# EAGLE board ACB Jr. r.02 (EAGLE 8.6.3)
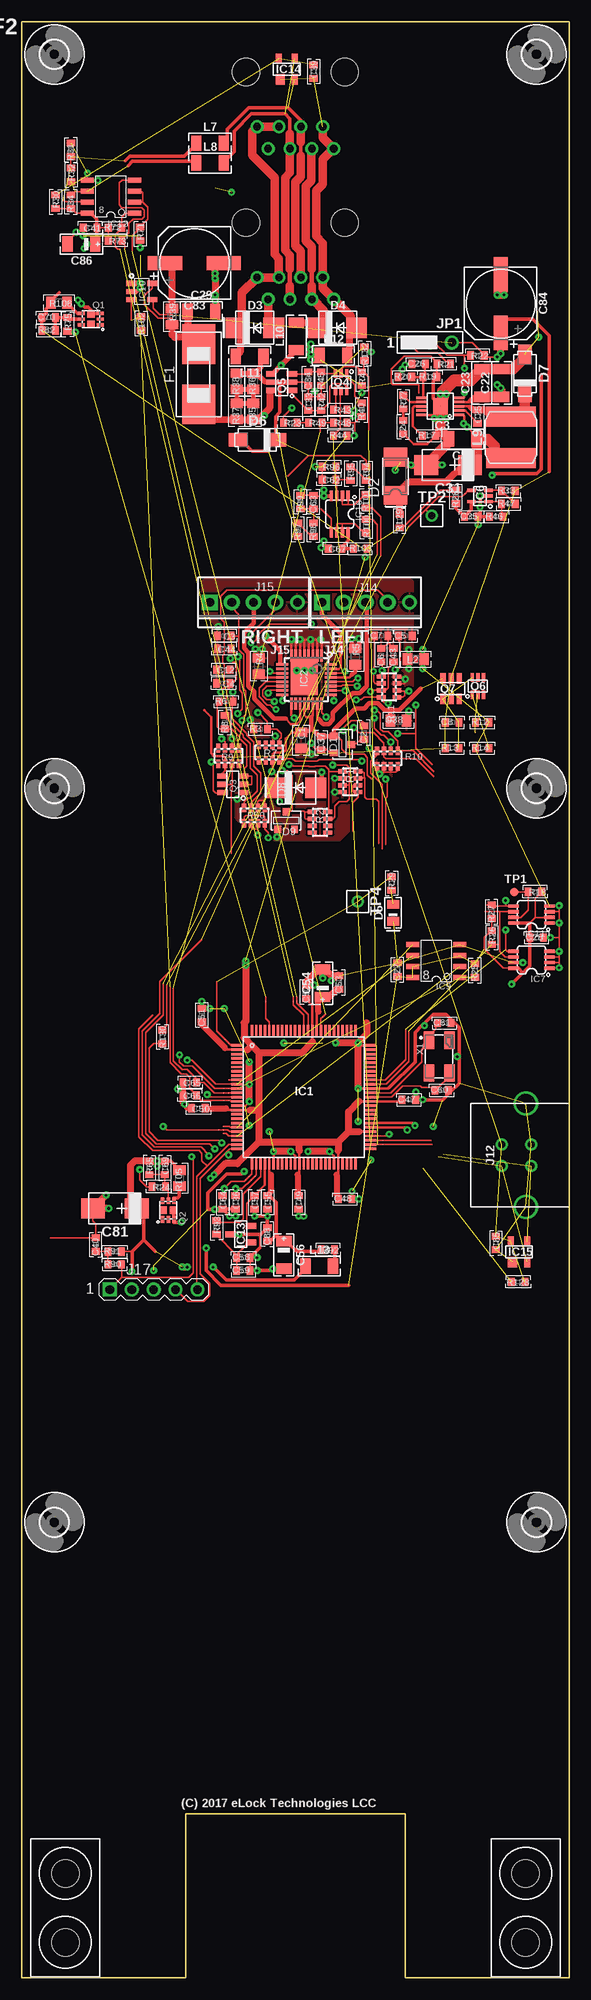
[diagram p6: board, top side]
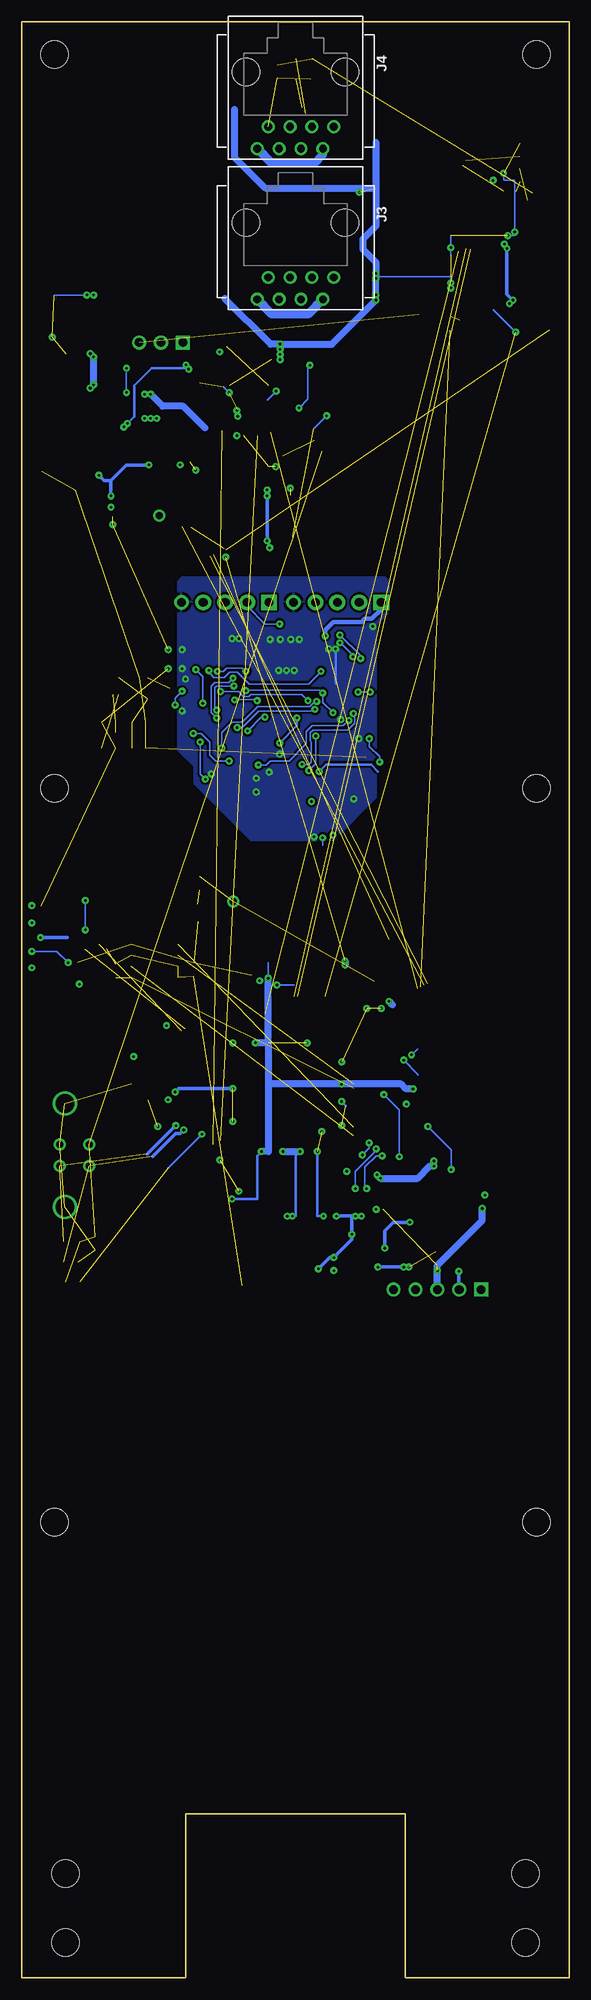
[diagram p7: board, bottom side, seen from below]

Size 63.5 x 226.82 mm. Coordinates in mm from the lower left corner, seen from the top.
Outline: 63.5,0 63.5,226.82 0,226.82 0,0 19.05,0 19.05,19.05 44.45,19.05 44.45,0 63.5,0
Copper layers (1*16): Top 0.035mm / dielectric 1.5mm / Bottom 0.035mm
Design rules "default *": minimum track width 0.2mm, minimum drill 0.3mm, track to track 0.2mm, track to pad 0.2mm, pad to pad 0.2mm, via to via 0.2mm, smd to smd 0.001mm, copper to edge 0.5mm, drill to drill 0.2mm, minimum pad ring 0.3mm, minimum via ring 0.25mm, stop-mask expansion 0.1mm, vias tented up to drill 0.6mm, thermal gap 0.35mm
Net classes: 1 HV: clearance 0.3 mm to class 0
tRestrict: area -41.7,17.1 to -37.9,17.6; 34 lines

## Footprints (pad centres in the part's own frame; a part is rotated, then mirrored left to right if it is on the bottom)
0805 = smd 1.092 x 1.397: 1 -0.94,0; 2 0.94,0
0603 = smd 0.762 x 0.965: 1 -0.787,0; 2 0.787,0
1206 = smd 1.19 x 1.79: 1 -1.6,0; 2 1.6,0
CT-C = smd 2.743 x 2.311: + -2.54,0; - 2.54,0
1206-POL-C = smd 1.19 x 1.79: + -1.6,0; - 1.6,0
CAP_8MM_DIA_SMT = smd 1.59 x 3.99: 1 0,3.4; 2 0,-3.4
SOT-23 = smd 0.787 x 0.889: 1 0.991,1.016; 2 -0.94,1.016; 3 0.025,-1.016
SMA = smd 2.159 x 2.743: + -2.311,0.003; - 2.108,-0.002
SMB = smd 2.4 x 2.4: A 2.2,0; C -2.2,0
0805-POL-D = smd 0.99 x 1.39: A 1,0; K -1,0
SMA' = smd 2.21 x 1.575: A -2.223,0; K 2.223,0
LITTLEFUSE0154 = smd 4.6 x 3.8: 1 3.5,0; 2 -3.5,0
CAM-HOLDER = hole 3.2: 0,4; 0,-4
3,2 = hole 3.2: 0,0
TQFP100_14X14_0,5MM = smd 1.39 x 0.28: 1 -7.7,6; 2 -7.7,5.5; 3 -7.7,5; 4 -7.7,4.5; 5 -7.7,4; 6 -7.7,3.5; 7 -7.7,3; 8 -7.7,2.5; 9 -7.7,2; 10 -7.7,1.5; 11 -7.7,1; 12 -7.7,0.5; 13 -7.7,0; 14 -7.7,-0.5; 15 -7.7,-1; 16 -7.7,-1.5; 17 -7.7,-2; 18 -7.7,-2.5; 19 -7.7,-3; 20 -7.7,-3.5; 21 -7.7,-4; 22 -7.7,-4.5; 23 -7.7,-5; 24 -7.7,-5.5; 25 -7.7,-6; 51 7.7,-6; 52 7.7,-5.5; 53 7.7,-5; 54 7.7,-4.5; 55 7.7,-4; 56 7.7,-3.5; 57 7.7,-3; 58 7.7,-2.5; 59 7.7,-2; 60 7.7,-1.5; 61 7.7,-1; 62 7.7,-0.5; 63 7.7,0; 64 7.7,0.5; 65 7.7,1; 66 7.7,1.5; 67 7.7,2; 68 7.7,2.5; 69 7.7,3; 70 7.7,3.5; 71 7.7,4; 72 7.7,4.5; 73 7.7,5; 74 7.7,5.5; 75 7.7,6 | smd 0.28 x 1.39: 26 -6,-7.7; 27 -5.5,-7.7; 28 -5,-7.7; 29 -4.5,-7.7; 30 -4,-7.7; 31 -3.5,-7.7; 32 -3,-7.7; 33 -2.5,-7.7; 34 -2,-7.7; 35 -1.5,-7.7; 36 -1,-7.7; 37 -0.5,-7.7; 38 0,-7.7; 39 0.5,-7.7; 40 1,-7.7; 41 1.5,-7.7; 42 2,-7.7; 43 2.5,-7.7; 44 3,-7.7; 45 3.5,-7.7; 46 4,-7.7; 47 4.5,-7.7; 48 5,-7.7; 49 5.5,-7.7; 50 6,-7.7; 76 6,7.7; 77 5.5,7.7; 78 5,7.7; 79 4.5,7.7; 80 4,7.7; 81 3.5,7.7; 82 3,7.7; 83 2.5,7.7; 84 2,7.7; 85 1.5,7.7; 86 1,7.7; 87 0.5,7.7; 88 0,7.7; 89 -0.5,7.7; 90 -1,7.7; 91 -1.5,7.7; 92 -2,7.7; 93 -2.5,7.7; 94 -3,7.7; 95 -3.5,7.7; 96 -4,7.7; 97 -4.5,7.7; 98 -5,7.7; 99 -5.5,7.7; 100 -6,7.7
SQFP-S-5X5-32 = smd 0.3 x 1.4: 1 -1.75,-2.8; 2 -1.25,-2.8; 3 -0.75,-2.8; 4 -0.25,-2.8; 5 0.25,-2.8; 6 0.75,-2.8; 7 1.25,-2.8; 8 1.75,-2.8; 17 1.75,2.8; 18 1.25,2.8; 19 0.75,2.8; 20 0.25,2.8; 21 -0.25,2.8; 22 -0.75,2.8; 23 -1.25,2.8; 24 -1.75,2.8 | smd 1.4 x 0.3: 9 2.8,-1.75; 10 2.8,-1.25; 11 2.8,-0.75; 12 2.8,-0.25; 13 2.8,0.25; 14 2.8,0.75; 15 2.8,1.25; 16 2.8,1.75; 25 -2.8,1.75; 26 -2.8,1.25; 27 -2.8,0.75; 28 -2.8,0.25; 29 -2.8,-0.25; 30 -2.8,-0.75; 31 -2.8,-1.25; 32 -2.8,-1.75 | smd 3.1 x 4.3: G 0.25,-0.35
MSOP10EXP = smd 0.29 x 1.19: 1 -1,-2.2; 2 -0.5,-2.2; 3 0,-2.2; 4 0.5,-2.2; 5 1,-2.2; 6 1,2.2; 7 0.5,2.2; 8 0,2.2; 9 -0.5,2.2; 10 -1,2.2 | smd 1.88 x 1.68: EP 0,0
SC-70-5 = smd 0.39 x 0.99: 1 -0.65,-1; 2 0,-1; 3 0.65,-1; 4 0.65,1; 5 -0.65,1
MSOP-08 = smd 0.38 x 1.2: 1 -1,-2.1; 2 -0.35,-2.1; 3 0.3,-2.1; 4 0.95,-2.1; 5 0.95,2.1; 6 0.3,2.1; 7 -0.35,2.1; 8 -1,2.1
SO-08 = smd 0.61 x 1.524: 1 -1.905,-2.743; 2 -0.635,-2.743; 3 0.635,-2.743; 4 1.905,-2.743; 5 1.905,2.743; 6 0.635,2.743; 7 -0.635,2.743; 8 -1.905,2.743
SOT23-5 = smd 0.6 x 1.2: 1 -0.95,-1.206; 2 0,-1.206; 3 0.95,-1.206; 4 0.95,1.206; 5 -0.95,1.206
SO08 = smd 0.61 x 1.524: 1 -1.905,-2.743; 2 -0.635,-2.743; 3 0.635,-2.743; 4 1.905,-2.743; 5 1.905,2.743; 6 0.635,2.743; 7 -0.635,2.743; 8 -1.905,2.743
SOT23 = smd 0.69 x 1.19: 1 0.95,1.2; 2 -0.95,1.2; 3 0,-1.2
SOT-143 = smd 1.09 x 1.19: 1 -0.75,-1.2 | smd 0.69 x 1.19: 2 0.95,-1.2; 3 0.95,1.2; 4 -0.95,1.2
RJ8-8-180 = drill 0.9 pad 1.4: 1 -4.445,6.35; 2 -3.175,8.89; 3 -1.905,6.35; 4 -0.635,8.89; 5 0.635,6.35; 6 1.905,8.89; 7 3.175,6.35; 8 4.445,8.89 | hole 3.2: 5.715,0; -5.715,0
USB_B_180 = drill 0.8 pad 1.4: 1_+5V 1.25,2.8; 2_D- -1.25,2.8; 3_D+ -1.25,-0.6; 4_GND 1.25,-0.6 | drill 2.2 pad 2.8: SH1 -6,0; SH2 6,0
3-641215-5 = drill 1 pad 1.829 square: 1 5.08,0 | drill 1 pad 1.829: 2 2.54,0; 3 0,0; 4 -2.54,0 | drill 1 pad 1.702: 5 -5.08,0
MA05-1 = drill 1 pad 1.6 square: 1 -5.08,0 | drill 1 pad 1.6: 2 -2.54,0; 3 0,0; 4 2.54,0; 5 5.08,0
JP3CLOSE12 = drill 1 pad 1.626 square: 1 -2.54,0 | drill 1 pad 1.626: 2 0,0; 3 2.54,0
0805-0RTOP = smd 1.092 x 1.397: 1 -0.94,0; 2 0.94,0
NR6028 = smd 2.3 x 5.7: 1 2.4,0; 2 -2.4,0
TEMP-PAD = smd 0.2 x 0.2: P$1 0,0
MICRO_FET = smd 0.4 x 0.8: 1 -0.65,-1.1; 2 0,-1.1; 3 0.65,-1.1; 4 0.65,1.1; 5 0,1.1; 6 -0.65,1.1 | smd 0.7 x 0.86: P1 -0.5,0; P2 0.5,0
SSOT-6 = smd 0.6 x 1.2: 1 -0.95,-1.2; 2 0,-1.2; 3 0.95,-1.206; 4 0.95,1.2; 5 0,1.2; 6 -0.95,1.2
SC70-6 = smd 0.39 x 0.99: 1 -0.65,-1; 2 0,-1; 3 0.65,-1; 4 0.65,1; 5 0,1; 6 -0.65,1
0603-ARRAY = smd 0.5 x 1: 1 -1.2,-0.9; 2 -0.4,-0.9; 3 0.4,-0.9; 4 1.2,-0.9; 5 1.2,0.9; 6 0.4,0.9; 7 -0.4,0.9; 8 -1.2,0.9
SMD_ROUND_1MM = smd 1 x 1: P$1 0,0
TH_ROUND_14MM08MM = drill 0.8 pad 1.4: P$1 0,0
7B = smd 2 x 1.2: 1 -1.9,-1.2; 2 1.9,-1.2; 3 1.9,1.2; 4 -1.9,1.2

## Placement (x,y rotation side)
C1  4.7u/16V  [0805]  32.4,143.49 270 top
C2  10nF  [0603]  39.7,144.39 90 top
C3  10nF  [0603]  23.5,155.59 180 top
C4  10nF  [0603]  23.4,150.09 180 top
C5  10nF  [0603]  44.5,155.59 0 top
C6  10nF  [0603]  41.7,153.39 90 top
C7  10nF  [0603]  41.7,155.59 0 top
C8  100n  [0603]  49.9,145.59 0 top
C12  10nF  [0603]  23.4,151.69 180 top
C22  4u7/50  [1206]  55.64,184.92 90 top
C23  4u7/50  [1206]  53.34,184.92 90 top
C24  1n  [0603]  44.24,179.82 90 top
C25  470n/25  [0603]  52.84,181.02 270 top
C26  10p  [0603]  46.04,187.12 0 top
C27  100n  [0603]  43.57,116.9 90 top
C28  100n  [0603]  59.71,120.62 0 top
C29  4u7/50  [1206]  20.84,193.22 0 top
C30  47u/6.3  [1206]  51.14,178.42 180 top
C31  47uTC  [CT-C]  49.44,175.42 180 top
C33  100n  [0603]  33.24,182.52 270 top
C34  1n  [0603]  33.24,185.42 90 top
C35  100n  [0603]  52.14,169.42 0 top
C36  100n  [0603]  24.81,89.92 270 top
C37  1u/16V  [0603]  34.7,143.19 270 top
C38  4.7u/16V  [0805]  43.7,145.79 0 top
C39  100n  [0603]  33.84,221.02 270 top
C40  100n  [0603]  8.61,85.02 90 top
C41  100n  [0603]  7.94,202.92 180 top
C43  10nF  [0603]  43.1,153.39 90 top
C44  10nF  [0603]  23.5,154.09 180 top
C47  100n  [0603]  44.91,101.82 0 top
C48  1u  [0603]  37.51,90.32 0 top
C49  100n  [0603]  32.11,89.92 270 top
C50  1u  [0603]  20.51,100.82 180 top
C51  100n  [0603]  20.91,111.62 90 top
C52  1u  [0603]  33.01,114.32 90 top
C53  10u  [0603]  36.81,115.42 90 top
C54  10uTA  [1206-POL-C]  34.91,115.32 90 top
C55  100n  [0603]  28.51,89.92 270 top
C56  10uTA  [1206-POL-C]  30.41,83.82 270 top
C57  100n->10n  [0603]  27.01,89.92 270 top
C58  100n  [0603]  25.71,83.52 0 top
C59  1u->100n  [0603]  25.71,82.02 0 top
C60  18p  [0603]  48.71,102.92 0 top
C61  18p  [0603]  49.01,110.72 0 top
C62  1n  [0603]  35.64,173.72 180 top
C63  1n  [0603]  33.84,171.12 90 top
C64  100n  [0603]  23.31,89.92 270 top
C65  1n  [0603]  19.51,103.82 180 top
C66  10n  [0603]  19.51,102.32 180 top
C67  10u  [0603]  36.34,165.72 180 top
C69  1n  [0603]  16.61,93.92 270 top
C70  1n  [0603]  3.14,192.52 0 top
C81  47uTC  [CT-C]  10.81,89.22 180 top
C83  220u/25V  [CAP_8MM_DIA_SMT]  20.04,198.82 90 top
C84  220u/25V  [CAP_8MM_DIA_SMT]  55.54,194.12 180 top
C85  100n  [0603]  54.97,85.2 270 top
C86  10uTA  [1206-POL-C]  6.94,201.02 180 top
C88  10u  [0603]  28.51,86.22 90 top
D1  BAT54S  [SOT-23]  37.2,142.99 90 top
D2  SMLVT3V3  [SMA]  43.34,174.22 90 top
D3  P6SMB20A  [SMB]  27.04,191.32 0 top
D4  P6SMB20A  [SMB]  36.64,191.32 0 top
D5  LED-GREEN  [0805-POL-D]  43.07,123.5 90 top
D6  SS14  [SMA']  27.34,178.32 0 top
D7  SS14  [SMA']  58.34,186.02 270 top
D8  P6SMB16A  [SMB]  31.9,137.99 0 top
D9  BZX84C6V2  [SOT-23]  30.7,134.19 180 top
F1  T1A-LITTLEFUSE0154  [LITTLEFUSE0154]  20.54,185.92 90 top
H1  CAM-HOLDER  [CAM-HOLDER]  58.42,8.13 0 top
H2  CAM-HOLDER  [CAM-HOLDER]  5.08,8.13 0 top
H3  MOUNT-HOLE3.2  [3,2]  3.81,223.01 0 top
H4  MOUNT-HOLE3.2  [3,2]  59.69,223.01 0 top
H5  MOUNT-HOLE3.2  [3,2]  3.81,137.92 0 top
H6  MOUNT-HOLE3.2  [3,2]  59.69,137.92 0 top
H7  MOUNT-HOLE3.2  [3,2]  3.81,52.83 0 top
H8  MOUNT-HOLE3.2  [3,2]  59.69,52.83 0 top
IC1  PIC32MX470F512L-I/PF  [TQFP100_14X14_0,5MM]  32.71,102.12 0 top
IC2  L6227Q  [SQFP-S-5X5-32]  33.03,150.53 180 top
IC3  LT3971EMSE  [MSOP10EXP]  48.54,182.22 90 top
IC6  MIC841LYC  [SC-70-5]  53.14,171.82 90 top
IC7  24LC32A-I/MS  [MSOP-08]  59.11,118.07 90 top
IC9  AT25SF321-SSHD  [SO-08]  48.07,117.9 90 top
IC10  MAX9938HEUK+T  [SOT23-5]  13.94,195.52 270 top
IC11  24LC32A-I/MS  [MSOP-08]  59.11,123.32 90 top
IC12  SN65HVD12D  [SO08]  10.34,206.52 90 top
IC13  REF3025  [SOT23]  25.41,86.22 270 top
IC14  TPD2E001DZDR  [SOT-143]  30.74,221.32 0 top
IC15  TPD2E001DZDR  [SOT-143]  57.67,84.2 0 top
IC16  MCP6042-I/MS  [MSOP-08]  36.84,169.72 180 top
J3  RJ8-8-180  [RJ8-8-180]  31.75,203.5 180 bottom
J4  RJ8-8-180  [RJ8-8-180]  31.75,220.97 180 bottom
J12  USB_A_180  [USB_B_180]  58.47,95.4 90 top
J14  3-641215-5  [3-641215-5]  39.9,159.49 180 top
J15  3-641215-5  [3-641215-5]  26.9,159.49 180 top
J17  DNP-open-hole  [MA05-1]  15.31,79.82 0 top
JP1  JP3CLOSE12  [JP3CLOSE12]  47.34,189.62 0 top
L2  DNP  [0805-0RTOP]  45.7,152.89 0 top
L7  HI1206T500R  [1206]  21.84,212.72 0 top
L8  HI1206T500R  [1206]  21.84,210.42 0 top
L9  NR6028T4R7M  [NR6028]  56.74,178.62 90 top
L10  HI1206T500R  [1206]  31.84,190.32 90 top
L11  HI1206T500R  [1206]  26.44,188.02 180 top
L12  HI1206T500R  [1206]  36.14,188.12 0 top
L13  LQM31PN3R3M00L  [1206]  34.51,82.52 0 top
O1  PIC-OUT  [TEMP-PAD]  24.01,108.42 0 top
O5  PIC-RPX  [TEMP-PAD]  24.01,104.12 0 top
O6  PIC-RPX  [TEMP-PAD]  24.01,103.12 0 top
O7  PIC-RPX  [TEMP-PAD]  24.01,102.62 0 top
O8  PIC-RPX  [TEMP-PAD]  24.01,101.72 0 top
O12  PIC-RPX  [TEMP-PAD]  23.41,98.72 0 top
O13  PIC-RPX  [TEMP-PAD]  23.41,97.92 0 top
O15  PIC-RPX  [TEMP-PAD]  26.41,92.92 90 top
O16  PIC-RPX  [TEMP-PAD]  27.01,92.92 0 top
O23  PIC-OUT  [TEMP-PAD]  28.31,113.22 0 top
O29  PIC-RPX  [TEMP-PAD]  31.51,113.22 0 top
O30  PIC-RPX  [TEMP-PAD]  31.91,113.22 0 top
O31  PIC-OUT  [TEMP-PAD]  34.91,111.42 0 top
O41  PIC-RPX  [TEMP-PAD]  41.86,97.12 180 top
O42  PIC-RPX  [TEMP-PAD]  41.31,96.62 180 top
O44  PIC-OUT  [TEMP-PAD]  23.41,98.32 0 top
Q1  SSM6P49NU,LFPZ  [MICRO_FET]  8.04,192.32 90 top
Q2  SSM6P49NU,LFPZ  [MICRO_FET]  17.01,89.02 0 top
Q3  FDC6330L  [SSOT-6]  24.5,138.39 90 top
Q4  FDG6303N  [SC70-6]  37.04,185.02 180 top
Q5  FDC6506P  [SSOT-6]  30.14,185.02 90 top
Q6  FDG6303N  [SC70-6]  52.9,149.79 0 top
Q7  FDC6506P  [SSOT-6]  49.8,149.49 0 top
R1  100K  [0603-ARRAY]  38.1,138.69 270 top
R2  33K  [0603-ARRAY]  34.6,133.99 270 top
R3  300R  [0603]  27.7,144.79 0 top
R4  0.12R  [0805]  27.5,152.09 270 top
R5  0.12R  [0805]  38.7,153.19 270 top
R6  649R  [0603]  23.7,147.99 0 top
R7  3.3K  [0603-ARRAY]  28.7,142.09 0 top
R8  649R  [0603]  23.6,145.59 90 top
R9  100K  [0603-ARRAY]  24,141.69 180 top
R10  1M  [0603-ARRAY]  42.4,141.39 0 top
R11  10K  [0603-ARRAY]  42.6,149.69 270 top
R12  1M  [0603]  53.4,145.59 0 top
R13  1M  [0603]  49.9,142.59 0 top
R14  300k  [0603]  53.4,142.59 0 top
R17  47k  [0603]  47.24,178.82 0 top
R18  10k  [0603]  59.51,125.92 180 top
R19  560k  [0603]  47.34,185.62 0 top
R20  1M  [0603]  44.44,185.62 0 top
R21  1M  [0603]  48.94,187.12 180 top
R22  4M99  [0603]  52.84,188.12 180 top
R23  1M  [0603]  31.14,180.32 180 top
R24  100k  [0603]  15.91,91.72 180 top
R25  1M  [0603]  52.57,116.8 90 top
R26  10k  [0603]  54.51,120.62 270 top
R27  10k  [0603]  54.51,123.62 90 top
R28  100R  [0603]  50.34,171.72 90 top
R29  300R  [0603]  42.87,126.9 270 top
R30  10k  [0603]  3.94,205.92 270 top
R31  1M  [0603]  5.73,211.94 90 top
R32  1M  [0603]  5.73,209.04 270 top
R33  4M99  [0603]  56.44,172.42 0 top
R34  1M  [0603]  5.74,205.92 90 top
R35  1k  [0805]  26.84,181.62 90 top
R36  1k  [0805]  26.84,185.12 90 top
R37  1k  [0805]  24.94,181.62 90 top
R38  1k  [0805]  24.94,185.12 90 top
R39  0.025R  [0805]  17.44,192.62 270 top
R40  300k  [0603]  39.44,181.82 90 top
R41  1M  [0603]  39.44,185.42 270 top
R42  1M  [0603]  34.74,182.52 270 top
R43  300k  [0603]  36.94,181.82 180 top
R44  1M  [0603]  36.94,178.82 0 top
R45  1M  [0603]  34.74,185.42 90 top
R46  560k->750k  [0603]  55.04,169.42 0 top
R47  100k->180k  [0603]  56.44,170.92 0 top
R48  1M  [0603]  36.94,180.32 180 top
R49  560k  [0603]  34.04,180.32 180 top
R50  100K  [0603-ARRAY]  27,134.79 0 top
R65  1M  [0603]  14.81,93.92 270 top
R71  10k  [0603]  13.74,202.22 270 top
R72  1M  [0603]  10.84,202.92 0 top
R73  1M  [0603]  10.84,201.42 180 top
R75  100k  [0603]  5.34,191.72 270 top
R77  47k  [0603]  44.24,182.72 270 top
R82  1M  [0603]  3.14,191.02 0 top
R90  1k  [0603]  10.81,82.72 0 top
R91  10k  [0603]  10.81,84.22 0 top
R92  10R  [0603]  35.51,84.42 180 top
R93  300R  [0603]  22.61,87.02 270 top
R94  180k  [0603]  39.94,174.42 270 top
R95  4M99  [0603]  38.14,174.42 270 top
R96  560k  [0603]  35.64,175.22 180 top
R97  180k  [0603]  32.04,167.92 90 top
R98  4M99  [0603]  33.84,167.92 90 top
R99  560k  [0603]  32.34,171.12 90 top
R100  2k2  [0603]  39.94,168.32 270 top
R101  2k2  [0603]  39.94,171.22 90 top
R102  1k  [0603]  13.84,191.82 270 top
R103  300R  [0603]  39.24,165.72 0 top
R105  1R  [0805]  18.31,92.72 90 top
R106  1R  [0805]  4.34,194.22 180 top
R128  10k  [0603]  57.57,80.7 180 top
R129  DNP/0R  [0603]  43.84,168.92 90 top
R130  100k  [0603]  16.31,109.12 270 top
R132  1M  [0603]  39.74,188.32 270 top
REF1  REF  [REF]  82.71,85.52 0 top  (outside the outline)
REF2  REF  [REF]  -3.86,223.52 0 top  (outside the outline)
T1  PIC-OUT  [TEMP-PAD]  52.6,144.39 0 top
T3  PIC-RPX  [TEMP-PAD]  23.46,102.62 180 top
T5  PIC-OUT  [TEMP-PAD]  41.86,96.62 180 top
T7  PIC-OUT  [TEMP-PAD]  41.31,97.12 180 top
T13  PIC-RPX  [TEMP-PAD]  31.51,113.77 0 top
T14  PIC-RPX  [TEMP-PAD]  31.91,113.77 270 top
T15  PIC-OUT  [TEMP-PAD]  35.26,111.77 270 top
T27  PIC-OUT  [TEMP-PAD]  23.46,103.12 270 top
T32  PIC-OUT  [TEMP-PAD]  22.86,98.32 270 top
T33  PIC-OUT  [TEMP-PAD]  28.31,113.77 270 top
T36  PIC-OUT  [TEMP-PAD]  23.61,108.82 0 top
T37  PIN-AN  [TEMP-PAD]  26.01,92.52 0 top
T38  PIN-AN  [TEMP-PAD]  26.61,92.52 270 top
T39  PIN-AN  [TEMP-PAD]  23.46,101.72 270 top
T45  PIC-RPX  [TEMP-PAD]  51.44,172.12 180 top
TP1  DNP-TestPoint  [SMD_ROUND_1MM]  57.11,125.92 0 top
TP2  DNP-TestPoint  [TH_ROUND_14MM08MM]  47.54,169.52 0 top
TP4  DNP-TestPoint  [TH_ROUND_14MM08MM]  38.97,124.8 270 top
X1  8MHz-5x3.2mm  [7B]  48.41,106.82 270 top

## Tracks (layer width: path | path; a pad name or v marks a point on that pad's centre or on a via)
+3,3V-FILT
  Top 0.4: R28.1 50.34,170.42 C35.1 52.14,170.22 IC6.5
+3.3V  (via drill 0.3 pad 0.7, 0.3 pad 0.8)  (4 unrouted)
  Top 0.2: R105.2 18.51,93.72 | 12.81,84.22 R91.2 | R129.1 43.94,168.22 44.24,168.22 48.54,172.52 R28.2 | R103.2 39.84,165.52 v39.84,164.72
  Top 0.28: C47.1 44.31,101.62 IC1.62 39.11,101.62 | 23.61,107.82 23.61,107.62 IC1.2 26.21,107.62 | 23.71,100.82 23.71,100.62 IC1.16 26.51,100.62 | 32.01,93.12 32.21,93.12 IC1.37 32.21,95.92 | 32.01,91.12 32.01,90.72 C49.1 | 36.51,93.12 36.71,93.12 IC1.46 36.71,95.92 | IC1.55 39.11,98.12 | C52.1 33.01,113.42 33.71,112.72 IC1.86 33.71,108.52
  Top 0.3: C69.1 16.51,94.72
  Top 0.4: R82.1 C70.1 2.84,193.02 2.84,193.52 3.34,194.02 R106.2 3.34,194.42 4.34,195.42 | v15.71,94.72 C69.1 17.31,94.72 R105.2 | 14.16,85.57 15.51,84.22 | v12.81,81.92 12.81,84.22 14.16,85.57 | 14.16,85.57 14.16,88.41 C81.+ | v22.21,82.42 23.71,80.92 31.61,80.92 32.91,82.22 L13.1
  Top 0.68: C51.1 20.91,110.52 23.61,107.82 | C50.1 23.71,100.82 | 32.01,93.12 32.01,91.12 | 36.51,93.12 36.51,90.82 36.71,90.62 C48.1
  Top 0.8: R28.2 50.24,172.52 | C81.+ 12.61,89.22 12.61,94.22 13.11,94.72 R65.1 v15.71,94.72 v15.71,94.12 | 26.71,108.12 25.81,109.02 25.81,110.72 26.01,110.92 v26.01,117.42 v26.01,117.92 | 26.21,107.62 26.71,108.12 | 26.71,108.12 27.51,107.32 | 27.51,107.32 27.51,100.62 | 27.51,100.62 27.51,96.92 | 27.51,96.92 25.01,94.42 23.61,94.42 v22.31,93.12 | 27.51,107.32 32.51,107.32 33.71,108.52 | 27.51,96.92 32.41,96.92 | 32.41,96.92 36.71,96.92 | 36.71,96.92 37.91,98.12 | 37.91,98.12 37.91,100.42 39.11,101.62 | 37.91,98.12 39.11,98.12 | 36.71,96.92 36.71,95.92 | 32.21,95.92 32.21,96.72 32.41,96.92 | 26.51,100.62 27.51,100.62 | 18.81,82.42 v18.61,82.42 v19.21,82.42
  Bottom 0.4: J17.2 12.81,79.86 v12.81,81.92 | v19.21,82.42 v22.21,82.42
  Bottom 0.8: v26.01,117.92 v26.01,117.42 | v22.31,93.12 v21.91,92.72 17.61,92.72 16.21,94.12 v15.71,94.12 v15.71,94.72
+3.3V/1  (via drill 0.3 pad 0.7, 0.3 pad 0.8)  (6 unrouted)
  Top 0.2: R26.1 54.51,121.52 | R27.1 54.51,121.52 | 54.51,121.52 53.61,120.62 53.61,119.32 55.86,117.07 IC7.8 | IC11.2 59.56,122.97 | 59.56,122.97 58.91,122.32 | R18.1 59.56,125.17 59.56,122.97 | 57.86,116.17 57.86,116.27
  Top 0.4: v21.41,84.62 21.41,82.02 23.11,80.32 37.91,80.32 | Q2.P2 17.66,89.02 Q2.3 17.66,87.62 v18.51,87.62 | IC11.8 58.91,122.32 C28.1 58.91,117.32 58.11,116.52 | 58.11,116.52 57.86,116.27 v56.81,115.22 | IC7.8 57.56,117.07 58.11,116.52
  Bottom 0.4: v18.51,87.62 20.41,87.62 21.41,86.62 v21.41,84.62
+3.3V/2  (via drill 0.3 pad 0.8)
  Top 0.2: C41.1 R72.1 R73.2 | R30.2 R34.1 5.84,205.12 6.34,204.61 IC12.8
  Top 0.3: 8.19,192.97 Q1.P2
  Top 0.4: Q1.3 8.19,192.97 | Q1.P2 8.04,193.42 7.74,193.72 7.34,193.72 v6.94,194.12 v6.54,194.52 | v7.24,200.52 7.24,200.72 v7.54,201.02 C86.+ 8.74,201.22 C41.1 8.74,203.92 8.04,204.61 IC12.8
  Bottom 0.4: v6.54,194.52 7.24,195.22 v7.24,200.52
/3.3V1PWRON  (via drill 0.3 pad 0.7)
  Top 0.2: v13.71,93.72 13.71,92.52 14.51,91.72 R24.2 | IC1.21 24.11,98.12 23.91,98.32 O44.P$1 T32.P$1 16.81,98.32 v16.41,98.72
  Bottom 0.2: v13.71,93.72 13.71,96.02 v16.41,98.72
/3.3V2PWRON  (via drill 0.3 pad 0.8)  (1 unrouted)
  Top 0.2: R75.2 5.44,190.82 v6.24,190.82 | IC1.96 28.71,110.82 28.31,111.22 O23.P$1 T33.P$1
  Bottom 0.2: v6.24,190.82 8.84,193.42
/FMEM1-CS  (via drill 0.3 pad 0.7)  (2 unrouted)
  Top 0.2: IC1.11 O6.P$1 T27.P$1 22.41,103.12 19.81,105.72 18.81,105.72 18.31,106.22 v18.31,107.02
  Bottom 0.2: 17.61,107.72 v18.31,107.02
/MCLR  (via drill 0.3 pad 0.7)
  Top 0.2: IC1.13 21.81,102.12 v21.51,102.42 | 11.63,81.22 19.41,81.22 19.91,81.72 19.91,95.02 v19.71,95.22 | 11.63,81.22 J17.1 | 11.63,81.22 11.63,82.7 R90.2
  Bottom 0.2: v19.71,95.22 19.71,100.62 v21.51,102.42
A+  (1 unrouted)
  Top 0.4: L8.2 23.44,210.52 24.64,211.72 24.64,214.12 26.64,216.12 30.54,216.12 31.1,215.55 31.1,213.84 31.11,213.84
  Top 0.5: 31.1,196.19 31.1,198.12
  Top 1: 31.1,198.12 31.1,199.75 30.54,200.32 30.54,208.72 31.1,209.28 J4.4 31.11,213.84 | J3.4 31.11,196.19 31.1,196.19
A++  (2 unrouted)
  Top 0.2: R34.2 5.84,206.72 6.24,207.12 7.56,207.12 IC12.6
  Top 0.4: 12.34,210.12 12.84,210.62 20.04,210.62 L8.1
ACT-L-SENSE
  Top 0.2: R1.8 39.5,139.89 39.7,139.69 39.7,139.19 | 39.7,139.19 39.8,139.09 39.8,136.89 40,136.69 41.1,136.69 41.4,136.39 41.4,131.51 | R1.7 39.6,139.09 39.7,139.19
ACT-L-SW  (via drill 0.3 pad 0.7)
  Top 0.2: v33.6,156.99 28.7,156.99 27.2,155.49 27.2,155.19 26.8,154.79 v26.6,154.79 | R2.8 35.6,135.29 35.6,139.89 | 35.6,139.89 R1.1 | 35.6,139.89 35.6,140.09 35.2,140.49 34.05,140.49 34,140.44 33.35,140.44 33.3,140.49 31.5,140.49 31.3,140.69 v31,140.69 | v25.05,146.59 25.6,147.14 25.6,148.99 25.3,149.29 25.3,152.99 v25.1,153.19 25.1,153.39 24.4,154.09 C44.1
  Bottom 0.2: J14.2 37.36,159.05 35.3,156.99 v33.6,156.99 | v25.1,153.19 25.1,153.39 26.5,154.79 v26.6,154.79 | v31,140.69 30.2,140.69 29.9,140.99 29.9,143.29 30,143.39 30,143.41 30.02,143.43 30.02,144.37 29.7,144.69 25.7,144.69 24.9,145.49 24.9,146.44 v25.05,146.59
ACT-R-SENSE
  Top 0.2: R1.6 38.5,138.29 38.4,138.19 38.4,137.59 38.5,137.49 R1.5 39,136.89 38.4,136.29 38.4,132.89
ACT-R-SW  (via drill 0.3 pad 0.7)
  Top 0.2: J15.2 24.36,158.93 25.2,158.09 25.2,155.59 | 38,138.29 38,136.69 37.7,136.39 36.8,136.39 36.3,135.89 36.3,134.59 36.1,134.39 R2.7 | 38,138.29 R1.3 | 38,138.29 38,140.34 37.7,140.64 v36.05,140.64 | 25.2,155.59 25.2,153.99 25.75,153.44 25.75,149.44 26,149.19 26,146.49 25.6,146.09 25.6,145.84 v25.55,145.79 | C3.1 25.2,155.59
  Bottom 0.2: v36.05,140.64 35.15,140.64 34.7,141.09 32.5,141.09 30.5,143.09 30.5,144.49 29.8,145.19 26.2,145.19 25.6,145.79 v25.55,145.79
ACT_EN  (via drill 0.3 pad 0.7)
  Top 0.2: 47.6,140.69 45.7,142.59 45.7,144.29 | 45.7,144.29 v45.7,147.59 | 44.3,149.19 43.6,149.19 R11.6 | v44.9,149.19 44.3,149.19 | R11.5 44.2,148.49 44.4,148.69 44.4,149.09 44.3,149.19 | v39.45,141.09 39.25,141.29 34.5,141.29 34.3,141.09 31.7,141.09 31.4,141.39 30.6,141.39 30.4,141.19 R7.4 | v43.6,144.29 45.7,144.29
  Bottom 0.2: v45.7,147.59 45.7,148.39 v44.9,149.19 | v39.45,141.09 41,141.09 41.7,141.79 41.7,143.29 42.7,144.29 v43.6,144.29
ACT_L1  (via drill 0.3 pad 0.7)
  Top 0.2: IC2.27 37.09,149.78 37.2,149.89 38.8,149.89 v38.9,149.79 | v40.9,146.99 41.2,146.99 41.6,146.59 41.6,144.79 41.9,144.49 42.5,144.49 43.6,143.39 R10.5 45.4,142.29 47.8,139.89
  Bottom 0.2: v38.9,149.79 40.9,149.79 41.1,149.59 41.1,147.19 v40.9,146.99
ACT_L2  (via drill 0.3 pad 0.7)
  Top 0.2: IC2.28 36.69,150.28 36.7,150.29 38.4,150.29 38.8,150.69 v39,150.69 | v40.9,146.09 40.9,144.89 41.7,144.09 42,144.09 v42.8,143.29 R10.6 | 42.2,131.39 42.2,136.79 42.4,136.99 42.4,138.79 v42.2,138.99
  Bottom 0.2: v39,150.69 39.5,150.19 41.1,150.19 41.5,149.79 41.5,147.25 41.52,147.23 41.52,146.71 v40.9,146.09 | v42.8,143.29 42.8,139.59 v42.2,138.99
ACT_L+
  Top 0.3: IC2.31 36.79,151.78 37,151.99 37,153.49
  Top 0.5: 37,153.49 37,155.89 34.8,158.09 34.8,159.47 J14.1
ACT_L-
  Top 0.3: IC2.23 34.28,146.11 34.4,145.99
  Top 0.5: 34.4,145.99 35,145.39 35.6,145.39 36.1,145.89 36.1,146.69 38.4,148.99 39.2,148.99 40,149.79 40,159.39 J14.3
ACT_R1  (via drill 0.3 pad 0.7)
  Top 0.2: IC2.13 28.29,150.28 27.55,149.54 27.55,148.54 28.5,147.59 28.8,147.59 29.3,147.09 v29.5,147.09 | v38.52,144.97 39.1,144.39 40.8,144.39 42,143.19 R10.7 42,141.59 42.2,141.39 45.7,141.39 47.8,139.29
  Bottom 0.2: v29.5,147.09 29.7,146.89 36,146.89 37.92,144.97 v38.52,144.97
ACT_R2  (via drill 0.3 pad 0.7)
  Top 0.2: IC2.14 28.44,149.78 27.95,149.29 27.95,148.69 28.45,148.19 29.1,148.19 v29.3,147.99 | v40.3,142.59 40.6,142.29 R10.8 41.2,141.79 40.5,141.09 40.5,139.69 41.8,138.39 41.8,131.55 41.82,131.53 41.82,130.87
  Bottom 0.2: v29.3,147.99 29.5,147.99 30.1,147.39 36.1,147.39 37.9,145.59 39.1,145.59 40.3,144.39 v40.3,142.59
ACT_R+  (via drill 0.3 pad 0.7)
  Top 0.3: 30,152.39 30,152.28 IC2.9
  Top 0.5: 30,152.39 30,153.89 v28.3,155.59
  Bottom 0.5: v28.3,155.59 28.3,156.29 27.4,157.19 24.1,157.19 23.7,157.59 22.9,157.59 21.82,158.67 J15.1
ACT_R-
  Top 0.3: IC2.19 32.28,145.77 31.9,145.39 31.2,145.39 30.6,145.99
  Top 0.5: 30.6,145.99 29.3,145.99 26.95,148.34 26.95,149.14 26.3,149.79 26.3,153.69 25.8,154.19 25.8,155.99 26.9,157.09 J15.3
AVDD
  Top 0.28: IC1.30 28.71,93.12 28.91,93.12
  Top 0.4: C55.1 28.71,90.72 29.51,89.92 29.51,86.12 | 29.51,86.12 30.21,85.42 C56.+ 30.71,85.42 31.91,84.22 34.71,84.22 R92.2 | C88.1 28.81,85.42 29.51,86.12
  Top 0.6: 28.91,91.22 28.91,91.12 C55.1
  Top 0.68: 28.91,93.12 28.91,91.22
B-  (1 unrouted)
  Top 0.4: J3.5 32.34,197.13 | L7.2 23.44,213.12 23.84,213.52 23.84,214.32 26.34,216.82 30.94,216.82 32.37,215.38 J4.5 | 32.37,211.29 32.37,212.85 32.38,212.86
  Top 1: 32.38,212.86 J4.5 | 32.37,211.29 32.37,208.85 31.74,208.22 31.74,200.82 32.37,200.18 J3.5
B--  (2 unrouted)
  Top 0.2: 4.84,206.12 5.04,205.92 7.56,205.92 IC12.7 | R31.1 R32.1
  Top 0.4: 12.04,210.72 12.54,211.22 18.84,211.22 19.84,212.22 19.84,212.32 L7.1
CURR-SENSE  (1 unrouted)
  Top 0.2: IC1.14 24.31,101.62 24.21,101.72 O8.P$1 T39.P$1 20.81,101.72 20.31,102.22 C66.1 19.51,103.12 19.51,104.42 19.11,104.82 18.51,104.82 17.21,106.12 17.21,114.92
D+  (via drill 0.3 pad 0.7)  (2 unrouted)
  Top 0.28: IC1.57 45.31,99.12 v45.61,98.82
  Bottom 0.4: v45.61,98.82 48.91,95.52
D-  (via drill 0.3 pad 0.7)  (2 unrouted)
  Top 0.28: IC1.56 44.41,98.62 v44.71,98.32
  Bottom 0.4: v44.71,98.32 45.11,97.92 45.61,97.92 48.31,95.22
DGND  (via drill 0.3 pad 0.7, 0.3 pad 0.8)  (38 unrouted)
  Top 0.152: IC3.10
  Top 0.2: R96.2 C62.2 34.84,172.72 v35.04,172.52 v35.04,171.82 33.94,171.82 C63.2 R99.2 | C58.2 C59.2 | C28.2 v61.31,120.62 62.31,120.62 | 38.64,180.32 39.34,181.02 R40.1 39.24,181.02 v38.54,181.72 38.44,181.82 R43.1 | R71.2 v13.74,200.62 | v39.44,183.82 R41.2 | v7.14,202.02 C41.2 | C86.- 5.34,201.32 6.34,202.32 v6.34,202.42 | v7.64,209.22 7.64,208.47 IC12.5 8.73,208.42 8.74,208.42 v8.84,208.42 | R48.1 38.64,180.32 | R21.2 48.14,187.32 47.44,188.02 44.34,188.02 42.84,186.52 42.84,184.92 43.04,184.72 46.04,184.72 46.04,183.72 | C51.2 v21.81,112.42 | R44.2 v38.54,178.82 38.64,178.92 38.64,180.32 | C81.- 8.27,87.76 8.61,87.42 C40.2 3.32,85.82 | 27.61,84.62 27.61,86.12 27.71,86.22 | IC11.4 62.31,124.27 v62.31,124.32 62.31,123.62 | IC7.7 v58.11,117.72 | IC11.3 62.31,123.62 | 62.31,123.62 v62.31,122.32 | IC7.1 62.31,117.07 v62.31,117.12 62.31,117.72 | IC7.2 62.31,117.72 | IC7.3 62.31,118.37 | 62.31,118.37 62.31,117.72 | IC7.4 v62.31,119.02 | v62.31,119.02 62.31,118.37 | IC11.1 v62.31,122.32 | v62.31,122.32 62.31,120.62 | 62.31,120.62 v62.31,119.02 | v22.41,89.12 C64.2 | v50.51,106.82 50.71,106.82
  Top 0.28: IC1.45 36.21,95.32 v35.71,95.82 | v31.21,95.82 31.71,95.32 IC1.36 | IC1.31 v29.21,95.82 | IC1.15 25.91,101.12 v26.41,101.62 | IC1.75 39.31,108.12 v39.01,108.42 | C51.2 v20.91,113.22 | 42.61,103.22 42.51,103.12 IC1.65 v39.01,103.12
  Top 0.3: IC3.10 48.54,181.22 | R19.2 R21.2 | C24.1 45.44,177.82 47.04,177.82 R17.2 48.59,179.37 | v39.11,90.32 C48.2 v38.31,91.22
  Top 0.4: IC3.EP 48.54,182.32 47.74,183.12 47.74,185.22 R19.2 | v49.24,183.62 48.84,183.62 v48.54,183.62 | IC6.2 v53.14,171.82 v53.14,170.52 53.14,169.62 C35.2 R46.1 | IC16.4 v35.04,171.82 | v34.74,165.82 34.84,165.72 C67.2 35.04,166.22 v35.04,166.62 | IC10.2 13.34,195.52 v13.74,195.92 v13.74,196.52 13.69,196.47 IC10.1 | IC13.3 v25.21,86.22 27.71,86.22 C88.2 v28.51,88.32 | C59.2 v27.31,82.02 28.71,82.02 28.91,82.22 v29.11,82.22 C56.- | 49.81,111.12 50.71,110.22 50.71,106.82 50.71,103.72 49.71,102.72 | 42.61,103.22 45.61,106.22 45.61,109.62 46.41,110.42 v46.71,110.42 46.71,110.72 47.71,111.72 49.21,111.72 49.81,111.12 | 49.81,111.12 C61.2 | 49.71,102.72 48.81,101.82 v46.51,101.82 C47.2 v45.71,102.72 | 49.71,102.72 C60.2 | v54.54,174.22 54.74,174.42 59.74,174.42 60.24,174.92 60.24,185.87 | C49.2 v32.11,88.32 v32.71,88.32 | C57.2 27.01,88.42 | 27.01,88.42 v27.01,88.32 | C55.2 v28.51,88.32 | v28.51,88.32 27.11,88.32 27.01,88.42 | 27.61,84.62 C58.2 v27.31,83.52 | v25.81,93.52 25.51,93.22 23.81,93.22 21.61,91.02 21.61,89.12 v22.41,89.12 | C64.2 v24.11,88.32 v24.81,88.32 C36.2 C64.2
  Top 0.5: 46.54,152.53 46.54,152.55 46.5,152.59 v46.5,151.79 46.5,152.79 | 46.5,152.79 v46.5,153.99 | L2.2 46.64,152.79 46.5,152.79
  Top 0.8: v39.01,108.42 v36.41,108.42 | v47.84,180.82 v48.54,180.82 v49.24,180.82 | L12.1 34.54,188.52 33.54,188.52 v33.54,188.82 | v33.54,188.82 v33.54,188.22 v33.54,187.62 34.54,187.62 | v33.54,188.82 v33.54,189.42 | C29.2 v22.44,194.52 v22.44,195.12 v22.44,197.02 v22.44,197.62 22.44,198.82 C83.2 | v34.91,115.92 C54.- | v35.91,115.62 36.51,116.22 C53.2 35.91,116.22 35.21,116.92 C54.- | v33.91,115.12 C52.2 33.01,115.52 34.41,116.92 C54.- | 40.01,110.72 40.01,109.42 v39.01,108.42 | C31.- v45.12,175.42 44.74,175.42 44.44,175.72 43.95,175.72 D2.- | v31.21,95.82 v29.21,95.82 | v35.71,95.82 v33.21,95.82 | v39.01,103.12 v39.01,108.42 | v26.41,101.62 v26.41,103.62 v26.41,106.22 | C50.2 19.41,100.82 v18.91,101.32 18.71,101.52 C66.2 18.71,103.12 | 18.71,103.12 C65.2 | v18.11,103.07 18.66,103.07 18.71,103.12 | v9.81,90.76 C81.- v10.11,89.22 | v55.14,195.12 55.14,197.52 C84.2 55.94,197.52 v55.94,195.12 v55.14,195.12
  Top 0.813: v48.74,175.42 C31.-
  Top 1.2: 48.54,181.22 IC3.EP 48.54,182.72 48.64,182.82 arc90 48.74,182.92 48.74,183.32 48.84,183.32 | v48.54,180.82 48.54,179.42 48.59,179.37 C30.2 49.54,178.06 C31.- | 53.24,186.42 C23.2 C22.2 56.99,186.52 58.34,187.87 D7.A
  Top 1.4: 53.24,186.42 52.04,185.22 50.14,185.22 48.84,183.92 48.84,183.62 48.84,183.32
  Top 1.6: 48.54,181.22 v48.54,180.82
  Bottom 0.2: 40.04,184.42 v39.44,183.82 | v38.54,181.72 38.54,181.17 v38.44,181.07 | 13.74,196.42 v13.74,195.92 | 13.74,202.02 v13.74,200.62 13.74,199.72 | v7.64,209.22 7.64,208.42 6.34,208.42 v6.34,202.42 6.34,202.02 v7.14,202.02 | v13.74,196.52 13.74,197.22 22.24,197.22 v22.44,197.02 | 59.73,195.12 v55.94,195.12 | 31.91,115.12 v33.91,115.12 | 34.91,117.72 v34.91,115.92 | v58.11,117.72 59.41,119.02 v62.31,119.02
  Bottom 0.28: v26.41,101.62 25.91,101.12 | v39.11,90.32 36.21,90.32 36.21,95.32 v35.71,95.82 | v32.11,88.32 31.71,88.32 31.71,95.32 v31.21,95.82 | v28.51,88.32 29.21,88.32 v29.21,95.82
  Bottom 0.4: v35.04,166.62 v35.04,171.82 | v48.74,175.42 51.34,175.42 53.14,173.62 | v24.81,88.32 25.21,88.32 | 25.21,88.32 v27.01,88.32 | 25.21,88.32 v25.21,86.22 25.21,85.62 v27.31,83.52 27.81,83.52 v29.11,82.22 | v61.31,120.62 58.21,120.62 | 53.14,173.62 v53.14,171.82 | v54.54,174.22 53.94,173.62 53.14,173.62 | v45.71,102.72 45.31,103.12 v39.01,103.12
  Bottom 0.8: J17.3 15.31,82.62 10.11,87.82 v10.11,89.22 | 22.44,212.82 22.44,207.52 | 22.44,207.52 22.44,203.12 23.94,201.62 23.94,200.42 22.44,198.92 v22.44,197.62 v22.44,197.02 v22.44,195.12 v22.44,194.52 27.54,189.42 v33.54,189.42 34.64,189.42 39.94,194.72 | 38.84,216.62 38.84,211.12 35.24,207.52 22.44,207.52 | 34.91,108.42 v36.41,108.42 | 42.24,179.72 44.74,182.22 47.14,182.22 v48.54,183.62 | 34.91,108.42 34.91,103.62 | 34.91,103.62 34.91,95.82 v35.71,95.82 | v33.21,95.82 v31.21,95.82 | v18.11,103.07 18.96,103.07 19.51,103.62 v26.41,103.62 34.91,103.62 | 20.51,112.82 v20.91,113.22 | 34.91,108.42 v34.91,115.92
  other vias: 23.51,112.42 47.71,98.72 40.51,94.82 26.41,98.82 39.01,99.32 30.41,108.42 24.34,207.02 15.31,82.02 28.71,98.12 59.94,190.22 52.94,168.52 32.34,172.72 34.04,175.22 43.32,174.82
DGND-F  (2 unrouted)
  Top 0.8: L12.2 37.94,188.32 37.94,188.82 38.04,188.92 38.04,190.72 38.74,191.42
  Top 1: D4.A 38.74,191.42 38.14,191.42 38.14,192.67 J3.8 34.92,195.88 J3.7 34.91,201.14 34.14,201.92 34.14,207.22 34.91,207.99 34.91,210.86 36.13,212.08 J4.8 34.92,213.35 J4.7 | 28.56,191.99 28.57,191.99 | 28.57,191.99 D3.A | J3.2 28.57,191.99
  Bottom 1: J4.8 36.13,212.08 34.47,210.42 29.54,210.42 28.56,211.39 28.57,211.4 J4.2 | J3.2 30.27,192.92 34.47,192.92 36.17,194.61 J3.8
DOOR_L  (via drill 0.3 pad 0.7)
  Top 0.2: R50.2 26.6,133.39 26.8,133.19 27.4,133.19 | R50.3 27.4,133.19 | 27.4,133.19 v27.4,132.49
  Bottom 0.2: v27.4,132.49 27.4,131.79
DOOR_L_SW  (via drill 0.3 pad 0.7)
  Top 0.2: J14.4 42.44,159.75 41.3,160.89 23.8,160.89 23.1,160.19 23.1,157.59 23.5,157.19 23.5,153.49 23.3,153.29 23.3,152.49 23.5,152.29 23.5,151.69 | R50.7 26.6,136.29 27.7,137.39 27.7,139.69 26.9,140.49 26.9,143.29 26.1,144.09 26.1,144.29 24.4,145.99 24.4,147.9 R6.2 24.5,148 v24.5,149.09 | 23.5,151.69 23.5,149.59 23.1,149.19 v23.1,149.09 | C12.1 23.5,151.69
  Bottom 0.2: v23.1,149.09 v24.5,149.09
DOOR_ON
  Top 0.2: R9.7 24.4,138.39 | 24.4,138.39 Q3.5 23.19,138.39 | 24.4,138.39 24.4,137.79 24.3,137.69 24.3,130.39
DOOR_R  (via drill 0.3 pad 0.7)
  Top 0.2: R50.1 25.8,134.59 26,134.79 28,134.79 28.2,134.59 R50.4 28.2,133.19 28.6,132.79 v28.6,132.19
  Bottom 0.2: v28.6,132.19 28.6,131.29
DOOR_R_SW  (via drill 0.3 pad 0.7)
  Top 0.2: J15.4 29.44,158.73 26.6,155.89 v26.6,155.69 | R50.8 25.8,136.39 26.2,136.79 26.5,136.79 27.3,137.59 27.3,139.49 26.5,140.29 26.5,143.09 25.7,143.89 25.7,144.09 23.6,146.19 R8.2 23.7,146.47 23.7,148.59 23.8,148.69 23.8,149.29 24.18,149.67 C4.1 24.4,150.09 24.9,150.59 24.9,152.39 24.7,152.59 24.5,152.59 24.2,152.89 v24.2,152.99
  Bottom 0.2: v26.6,155.69 24.2,153.29 v24.2,152.99
GATE-Q12A
  Top 0.2: Q5.1 31.34,183.62 C33.2 R42.2 35.74,182.72 35.74,184.52 36.04,184.82 37.34,184.82 37.69,184.47 Q4.6
GATE-Q12A1  (3 unrouted)
GATE-Q12B
  Top 0.2: Q5.3 32.99,185.97 C34.2 R45.2 34.94,186.02 Q4.3
LAN-CTL  (1 unrouted)
  Top 0.2: IC12.3 13.08,207.12 13.94,207.12 14.07,206.98 14.07,205.88 | IC1.84 34.71,111.22 O31.P$1 T15.P$1 | 12.84,200.22 12.84,202.02 13.44,202.62 13.44,203.02 R71.1 14.64,203.92 14.64,205.32 14.07,205.88 | 14.07,205.88 IC12.2
LAN-RX  (1 unrouted)
  Top 0.2: IC12.1 12.13,204.61 11.64,204.12 R72.2 10.84,202.12 10.84,200.72 11.14,200.42 11.44,200.42 | IC1.88 32.71,111.62 31.51,112.82 O29.P$1 T13.P$1
LAN-TX  (1 unrouted)
  Top 0.2: IC12.4 11.64,208.42 11.34,208.12 11.34,205.57 11.64,205.27 13.94,205.27 14.24,204.97 14.24,204.22 13.94,203.92 12.94,203.92 12.44,203.42 12.44,202.32 11.64,201.52 R73.1 11.94,201.12 11.94,200.52 | IC1.87 33.21,111.72 31.91,113.02 O30.P$1 T14.P$1
LED-PIC  (2 unrouted)
  Top 0.2: IC1.1 24.31,108.12 O1.P$1 T36.P$1 22.61,109.82 22.61,115.52
N$1  (via drill 0.3 pad 0.7)
  Top 0.2: IC2.25 36.19,148.78 36.2,148.79 v36.2,148.09 | v38.8,148.19 39.4,148.19 39.7,148.49 R11.4 41.7,148.19 42.1,147.79 v42.5,147.79 | C5.1 43.71,155.07 43.9,154.89 43.9,151.99 43.6,151.69 v43.3,151.69
  Bottom 0.2: v36.2,148.09 36.3,148.19 v38.8,148.19 | v42.5,147.79 42.5,150.89 v43.3,151.69
N$2  (via drill 0.3 pad 0.7)
  Top 0.2: IC2.16 30.23,148.16 v30.3,148.09 | v40.45,149.14 40.75,149.14 40.9,149.29 R11.3 42.2,149.29 42.5,149.59 42.5,151.89 43.1,152.49 C43.1
  Bottom 0.2: v30.3,148.09 31,148.79 36.95,148.79 37.15,148.59 37.8,148.59 38.35,149.14 v40.45,149.14
N$3  (via drill 0.3 pad 0.7)
  Top 0.2: IC2.11 29.01,151.28 v28.8,151.49 | R11.1 41.6,150.99 41.6,151.39 v41.8,151.59 41.8,152.29 41.7,152.39 C6.1
  Bottom 0.2: v28.8,151.49 28.8,151.39 30.2,149.99 37.1,149.99 38.5,151.39 39.4,151.39 40,150.79 41.2,150.79 41.6,151.19 41.6,151.39 v41.8,151.59
N$4  (1 unrouted)
N$6  (via drill 0.3 pad 0.7)
  Top 0.2: IC2.24 34.78,146.71 v35.3,146.19 | v37.3,144.59 37.3,144.89 38.2,145.79 39.4,145.79 39.7,145.49 C2.2
  Bottom 0.2: v35.3,146.19 35.7,146.19 v37.3,144.59
N$13
  Top 0.2: IC11.7 57.86,122.97 58.71,123.82 R18.2 TP1.P$1
N$14  (1 unrouted)
N$16
  Top 0.2: Q4.1 37.69,185.67 38.64,184.72 38.64,183.42 R40.2
N$17
  Top 0.2: R43.2 36.39,182.07 Q4.4
N$18  (2 unrouted)
  Top 0.2: R30.1 3.94,206.92 4.24,206.92
N$19
  Top 0.2: C2.1 39.31,143.6 38.8,143.09 38.29,143.09 D1.3
N$20
  Top 0.6: R38.1 R37.2 R35.2 R36.1 R38.1
N$21
  Top 0.2: R39.2 17.44,192.42 15.84,192.42 14.24,194.02 14.24,195.02 15.15,195.92 IC10.5
  Top 0.8: C29.1 19.24,190.22 | 19.24,190.22 20.04,189.42 F1.1 | 19.24,190.22 17.74,190.22 17.44,190.52 R39.2
N$24
  Top 0.4: R92.1 36.31,82.72 L13.2
N$27
  Top 0.2: IC6.1 55.39,171.17 R47.1 55.64,169.62 R46.2
N$28
  Top 0.2: R47.2 57.14,170.92 R33.1 55.59,172.47 IC6.3
N$29  (via drill 0.3 pad 0.7)
  Top 0.2: R7.6 29.1,143.69 v29.4,143.99 | v30.2,139.99 30.8,139.99 31.4,139.39 31.4,135.29 | 31.4,135.29 30.76,135.29 D9.3 | R2.2 32.9,134.39 32.8,134.49 32.8,135.19 | 32.8,135.19 32.7,135.29 31.4,135.29 | 32.8,135.19 R2.1
  Bottom 0.2: v29.4,143.99 29.4,140.79 v30.2,139.99
N$31
  Top 0.3: IC2.12 27.61,150.78 27.5,150.89 R4.2
N$32
  Top 0.2: IC1.64 42.81,102.62 46.41,106.22 46.41,107.62 47.21,108.42 X1.1 47.51,109.02 47.51,109.52 48.01,110.02 48.01,110.52 C61.1
N$35  (via drill 0.3 pad 0.7)
  Top 0.2: R9.3 23.6,143.29 v23.2,143.69 | v22,140.99 22.2,140.79 22.2,137.69 22.5,137.39 23.14,137.39 Q3.6
  Bottom 0.2: v23.2,143.69 23.2,142.79 22,141.59 v22,140.99
N$36
  Top 0.4: Q1.4 6.49,192.97 5.74,193.72 5.44,193.72 5.44,194.12 R106.1
N$38  (via drill 0.3 pad 0.7)  (1 unrouted)
  Top 0.2: 27.99,181.27 v28.14,181.12
  Top 0.6: Q5.6 28.79,184.07 28.74,184.02 28.74,183.92
  Top 0.8: 28.74,183.92 28.74,182.02 27.99,181.27 27.34,180.62 R35.1 R37.1 22.04,180.62 20.54,182.12 F1.2
  Bottom 0.2: v28.14,181.12 29.64,179.62
N$39
  Top 0.2: IC1.63 42.91,102.12 44.21,103.42 46.21,103.42 46.41,103.22 48.21,103.22 | X1.3 49.61,104.52 48.31,103.22 48.21,103.22 | 48.21,103.22 C60.1
N$40
  Top 0.2: R6.1 22.7,147.79 22.7,145.09 23,144.79 23.58,144.79 R8.1 24.38,144.8 25.3,143.89 25.3,143.69 26.1,142.89 26.1,140.49 25.8,140.19 25.8,139.34 Q3.3 26.7,139.34 26.7,138.39 Q3.2
N$41
  Top 0.3: IC2.29 37.99,150.78 38.3,151.09
  Top 0.5: 38.3,151.09 38.7,151.49 R5.2
N$44
  Top 0.2: C59.1 C58.1 24.91,83.82 | R93.2 22.61,86.12 24.91,83.82 | IC13.1 26.36,85.27 24.91,83.82
N$47  (via drill 0.3 pad 0.7)
  Top 0.3: IC2.17 31.28,146.41 v31.6,146.09 | v33.6,143.19 33.6,142.99 34.1,142.49 34.61,142.49 C37.2 35.38,142.4 35.7,142.09 36.14,142.09 D1.2
  Bottom 0.3: v31.6,146.09 31.6,145.19 v33.6,143.19
N$48
  Top 0.2: R95.1 38.34,175.22 R94.2
N$49
  Top 0.2: R95.2 38.14,173.72 C62.1 | C62.1 R96.1 | IC16.3 36.54,173.72 C62.1
N$50
  Top 0.152: IC3.6 46.54,183.22
  Top 0.3: R19.1 46.54,183.22 IC3.6 | R20.2 R19.1 | R19.1 46.64,185.62 46.74,185.72 46.74,187.02 C26.2
N$51
  Top 0.3: R77.2 C24.2
N$52
  Top 0.152: IC3.3 51.14,182.22
  Top 0.3: IC3.3 51.14,182.22 51.84,182.22 51.94,182.12
  Top 0.5: 52.44,181.82 52.14,182.12 51.94,182.12 52.34,181.72
  Top 0.8: 52.44,181.82 C25.1 53.64,181.82 54.44,181.02 L9.1
  Top 1.2: L9.1 57.84,181.02 58.34,181.52 D7.K
N$53
  Top 0.152: 46.13,182.22 IC3.8
  Top 0.3: IC3.8 46.13,182.22 45.54,182.22 45.34,182.02 45.34,179.92 R17.1
N$54
  Top 0.152: 46.16,182.72 IC3.7
  Top 0.3: IC3.7 46.16,182.72 45.04,182.72 R77.1
N$55  (via drill 0.3 pad 0.8)
  Top 0.152: IC3.5
  Top 0.2: R22.2 51.34,188.12 | 51.34,188.12 v51.34,186.62 | 51.34,188.12 49.34,188.12 47.84,189.62 JP1.2
  Top 0.3: IC3.5 51.24,183.22 51.34,183.32 v51.34,183.82
  Bottom 0.2: v51.34,183.82 v51.34,186.62
N$56
  Top 0.4: R105.1 18.31,90.62 18.11,90.42 17.66,90.42 Q2.4
N$57
  Top 0.152: IC3.2 51.09,181.72
  Top 0.3: IC3.2 51.09,181.72 51.44,181.72 52.84,180.32 C25.2
N$60
  Top 0.2: R98.1 33.64,167.12 R97.2
N$62
  Top 0.2: R49.2 R23.1
N$63
  Top 0.2: C63.1 R99.1 | C63.1 R98.2 | IC16.5 35.89,169.17 34.74,170.32 C63.1
N$64
  Top 0.2: IC16.7 37.19,168.62 | 37.19,168.62 36.54,168.62 IC16.6 | R100.2 39.74,167.52 38.64,168.62 37.19,168.62
N$65
  Top 0.4: IC16.8 37.84,166.62 37.24,166.02 37.24,165.82 C67.1 R103.1
N$66
  Top 0.2: IC16.1 37.84,170.82 | 37.84,170.82 37.19,170.82 IC16.2 | R101.2 39.84,172.02 38.64,170.82 37.84,170.82
N$67
  Top 0.2: R65.2 C69.2 16.61,91.82 R24.1 17.01,91.42 Q2.5
N$68  (1 unrouted)
  Top 0.2: IC10.3 12.73,192.22
N$70
  Top 0.2: R90.1 R91.1 C40.1
N$71  (via drill 0.3 pad 0.7)
  Top 0.2: IC2.30 37.29,151.28 v37.5,151.49 | R11.2 41,150.09 40.8,150.29 v40.8,151.49 40.8,151.99 40.9,152.09 40.9,155.57 C7.1
  Bottom 0.2: v37.5,151.49 37.9,151.89 39.7,151.89 40.1,151.49 v40.8,151.49
N$73
  Top 0.4: Q1.5 5.54,192.32 R75.1 C70.2 R82.2
N$78  (via drill 0.3 pad 0.7)
  Top 0.2: IC2.26 37.49,149.28 37.5,149.27 v37.5,149.24 | v28.6,148.99 28.9,149.29 IC2.15 | R7.5 29.9,143.59 30.1,143.79 30.1,144.29 29.6,144.79 28.6,144.79 28.5,144.69 | v27.4,146.69 27.5,146.69 28.5,145.69 R3.2 | R3.2 28.5,144.69 | 28.5,144.69 28.5,144.6 | R3.2
  Bottom 0.2: v37.5,149.24 37.45,149.29 29,149.29 28.7,148.99 v28.6,148.99 28.6,147.89 v27.4,146.69
N$85  (4 unrouted)
  Top 0.4: D6.A 25.44,178.32 26.74,177.02 28.64,177.02
N$87
  Top 0.2: R21.1 49.44,187.42 49.24,187.42 48.24,188.42 46,188.42 JP1.1
OUT+3.3V  (via drill 0.3 pad 0.8)
  Top 0.152: IC3.1 50.96,181.22
  Top 0.3: 50.64,181.22 50.96,181.22 51.14,181.22 51.34,181.02 51.34,180.32 v51.24,180.22 v51.64,179.82 52.74,178.72 C30.1 | R20.1 43.64,185.82 44.14,186.32 v44.14,186.52 44.14,186.72 v44.44,187.02 44.54,187.12 C26.1
  Top 0.8: D2.+ 44.85,173.42 49.18,173.42 51.18,175.42 C31.+ | D2.+ 43.23,171.91 | R129.2 43.84,171.9 43.84,171.91 D2.+
  Top 1.2: C31.+ 52.74,176.18 C30.1 54.04,178.42 54.84,177.62 54.84,176.42 55.04,176.22 L9.2
  Bottom 0.3: v44.14,186.52 44.24,186.62 48.44,186.62 50.44,184.62 50.44,181.02 v51.64,179.82
PGC
  Top 0.2: IC1.24 24.01,96.62 21.51,94.12 | 21.51,94.12 20.31,92.92 20.31,79.9 J17.5 | 21.51,94.12 20.91,94.72 20.91,95.62 20.61,95.92 15.21,95.92 13.61,97.52 13.61,110.02 15.21,111.62
PGD  (via drill 0.3 pad 0.8)
  Top 0.2: IC1.25 24.11,96.12 23.71,95.72 | J17.4 19.25,78.42 21.11,78.42 21.81,79.12 21.81,80.52 20.71,81.62 20.71,92.72 23.71,95.72 | 23.71,95.72 v24.01,95.42 | v23.21,96.82 22.91,97.12 15.81,97.12 14.81,98.12 14.81,107.8 15.34,108.33 R130.2
  Bottom 0.2: v24.01,95.42 23.21,96.22 v23.21,96.82
PGND  (via drill 0.3 pad 0.7)
  Top 0.2: IC2.4 IC2.21 | R11.7 44.4,150.09 44.5,150.19 v44.5,150.59 44.3,150.79 43.8,150.79 43.8,150.89 R11.8 | R10.4 43.6,139.99 43.4,139.79 42.8,139.79 | 42.8,139.79 41.9,139.79 | 41.9,139.79 41.5,139.79 | R10.1 41.2,139.89 41.3,139.79 41.5,139.79 | R10.3 42.8,139.79 | R10.2 42,139.89 41.9,139.79 | 41.5,139.79 v41.5,139.59 | R1.2 v36.3,139.09 | R1.4 v36.3,137.49 | D9.1 29.61,133.17 29.6,133.19 v29.6,132.29 | v25,136.69 25.3,136.69 25.5,136.89 25.5,137.44 Q3.1 | C7.2 42.48,154.8 | R3.1 26.91,145.47 v26.5,145.89 | R9.2 v24.4,143.69 | v32.8,151.59 32.78,151.57 IC2.G | v33.7,151.59 v32.8,151.59 | v32.8,151.59 v31.9,151.59 | 42.48,154.8 42.48,154.77 41.88,154.17 C6.2 | 42.48,154.8 C43.2 | R50.6 27.4,136.39 27.5,136.49 28.2,136.49 R50.5
  Top 0.3: IC2.1 34.78,155.19 v34.7,155.19 34.3,155.19 | IC2.8 31.28,155.17 v31.3,155.19 31.7,155.19 | IC2.7 31.78,155.11 31.7,155.19 | 31.7,155.19 v32.3,155.19 | v32.3,155.19 32.8,155.19 | 32.8,155.19 33.2,155.19 | 33.2,155.19 v33.5,155.19 33.8,155.19 | 33.8,155.19 34.3,155.19 | IC2.2 34.28,155.17 34.3,155.19 | IC2.3 33.78,155.17 33.8,155.19 | IC2.4 33.28,155.11 33.2,155.19 | IC2.5 32.78,155.17 32.8,155.19 | IC2.6 32.28,155.17 v32.3,155.19
  Top 0.4: C38.2 44.64,146.63 v44.9,146.89 | C1.2 32.94,142.55 v33.6,141.89
  Top 0.5: R5.1 38.94,154.13 39.1,154.29 v39.1,155.29 v38.3,155.29 38.3,154.09 38.7,154.09 | R4.1 27.26,153.03 27.1,153.19 v27.1,154.09 v27.9,154.09 27.9,153.19 27.8,153.09 | D8.A 34.1,138.09 34.8,138.79 v34.8,139.79 | L2.1 44.7,152.89 44.9,153.09 v44.9,153.99 v44.9,151.79
  Bottom 0.3: v27.1,154.09 27.1,150.09
  other vias: 22.8,156.69
  pour Bottom (isolate 0.254): 45.4,161.89 45.4,142.39 43.5,140.49 43.5,138.49 36.9,131.89 27.4,131.89 22.4,136.89 22.4,156.89 20.9,158.39 20.9,161.89 21.4,162.39 44.9,162.39
  pour Top (isolate 0.254): 45.4,161.89 45.4,142.39 42.9,139.89 42.9,137.89 36.9,131.89 27.4,131.89 22.4,136.89 22.4,156.89 20.9,158.39 20.9,161.89 21.4,162.39 44.9,162.39
POWER-GOOD  (1 unrouted)
  Top 0.2: R130.1 16.81,110.42 16.81,115.12 | IC6.4 52.14,172.42 51.74,172.42 T45.P$1 51.04,171.72 48.34,171.72 46.84,170.22 | 46.84,170.22 44.89,168.27 | TP2.P$1 46.84,170.22
REF2,5V
  Top 0.2: C57.1 26.11,89.82 26.11,87.32 26.26,87.17 IC13.2
  Top 0.28: IC1.29 28.21,91.92 C57.1
REF-EN
  Top 0.2: IC1.28 27.71,92.92 25.71,90.92 25.71,88.02 25.31,87.62 22.81,87.62 R93.1
SCL1-EEPROM  (1 unrouted)
  Top 0.2: 55.41,119.82 55.41,119.02 56.06,118.37 IC7.6 | 55.41,119.82 55.41,123.62 | R26.2 55.41,119.82 | IC1.66 42.26,103.62 44.91,106.27 44.91,109.82 | IC11.6 55.41,123.62 | 55.41,123.62 53.71,123.62
SCLK2-SPI  (via drill 0.3 pad 0.7)  (1 unrouted)
  Top 0.2: IC1.10 22.51,103.62 19.71,106.42 v19.21,106.42
  Bottom 0.2: 17.51,104.72 v19.21,106.42
SD-CS
  Top 0.2: IC1.9 O5.P$1
SDA1-EEPROM  (via drill 0.3 pad 0.7)  (1 unrouted)
  Top 0.2: v56.11,121.52 56.11,119.22 56.31,119.02 IC7.5 | 57.06,124.32 IC11.5 56.11,124.27 | IC1.67 42.16,104.12 44.51,106.47 44.51,110.02 | 53.81,124.42 R27.2 54.66,124.27 56.11,124.27 | v56.11,124.92 56.11,124.27
  Bottom 0.2: v56.11,121.52 v56.11,124.92
SDI2-MISO  (1 unrouted)
  Top 0.2: O13.P$1 23.71,97.92 24.01,97.62 IC1.22
SDO2-MOSI  (1 unrouted)
  Top 0.2: IC1.20 24.21,98.62 24.11,98.72 O12.P$1
VACT  (via drill 0.3 pad 0.7)  (1 unrouted)
  Top 0.2: 40.6,138.99 40.1,139.49 40.1,141.49 39.7,141.89 37.7,141.89 37.1,142.49 37.1,143.49 36.7,143.89 36.27,143.89 D1.1
  Top 0.3: IC2.22 33.78,146.37 33.6,146.19 33,146.19 32.78,146.41 IC2.20 | 32.37,144.39 31.3,144.39 30.6,143.69 30.6,142.39 30.3,142.09 29.3,142.09 29.1,141.89 R7.3 29.1,139.89 | 29.1,139.89 29.1,139.79 29.9,138.99 29.9,138.19 | 29.9,138.19 D8.C | 29.9,138.19 v29.9,136.39 | v29,139.89 29.1,139.89
  Top 0.4: 33.27,144.56 32.53,144.56 C1.1 32.37,144.4 32.37,144.39
  Top 0.5: 33.27,144.56 33.6,144.89 | 33.6,144.89 33.6,146.19 | 33.6,144.89 34.51,143.97 C37.1 34.71,143.99 | D1.1 36.18,144.67 38.7,147.19 39.7,147.19 40.3,147.79 41.3,147.79 42.1,146.99 42.76,146.99 | 42.76,146.99 43.8,146.99 46.3,149.49 | 42.76,146.99 C38.1
  Top 0.6: C37.1 D1.1
  Bottom 0.3: 22.2,139.89 23,140.69 28.2,140.69 v29,139.89
VACT-ON  (2 unrouted)
VBAT  (via drill 0.3 pad 0.8)  (6 unrouted)
  Top 0.152: IC3.4 51.14,182.72
  Top 0.2: R39.1 17.44,192.82 16.04,192.82 15.24,193.62 15.24,194.32 15.49,194.57 IC10.4 | JP1.3 52.24,189.62 53.64,188.22 R22.1 53.84,187.92 v55.14,187.92 | 23.19,139.58 Q3.4
  Top 0.3: IC3.4 51.14,182.72 51.84,182.72 51.94,182.82 | 21.2,146.99 22,146.19 22,141.99 22.3,141.69 23.4,141.69 23.6,141.49 R9.6 23.6,139.99 23.19,139.58
  Top 0.4: 61.14,174.62 61.14,190.42 59.24,192.32 55.54,192.32 55.54,192.02 55.39,191.87
  Top 0.5: 53.14,183.12 C23.1 | 52.44,183.12 52.14,182.82 51.94,182.82 52.34,183.22
  Top 0.8: 52.44,183.12 52.64,183.12 52.84,183.32 C23.1 | v55.14,184.72 v55.54,184.32 55.64,184.22 C22.1 | 17.64,198.82 C83.1 17.44,198.82 R39.1 | v55.14,187.92 v55.54,188.32 C84.1 55.54,191.72 55.39,191.87
  Top 1.21: C23.1 C22.1
  Bottom 0.8: v55.54,184.32 v55.14,184.72 v55.14,187.92 v55.54,188.32
VBAT-LAN
  Top 0.8: D3.C 25.34,191.32 25.34,188.52 L11.2
  Top 1: J4.3 J4.1 26.8,214.11 26.74,214.11 26.74,211.32 29.33,208.72 29.33,199.82 29.83,199.32 J3.3 J3.1 25.54,195.41 25.54,191.92 24.94,191.32 D3.C
VBAT-LAN-F  (via drill 0.3 pad 0.7)  (2 unrouted)
  Top 0.2: R94.1 39.94,175.92 39.34,176.52 33.24,176.52 30.84,174.12 | C34.1 32.84,185.02 Q5.2 | C33.1 C34.1 | C33.1 R42.1 R45.1 | R45.1 34.84,184.62 | 34.64,183.32 v33.99,183.97 | v33.99,183.97 33.34,183.32 C33.1 | v33.99,183.97 33.34,184.62 C34.1 | v33.99,183.97 34.64,184.62 R45.1 | R132.1 40.34,188.52 v40.54,188.52
  Top 0.4: 29.74,185.02 29.94,184.82 29.94,181.52 29.44,181.02 29.44,178.82 29.56,178.69 D6.K | R42.1 34.64,183.32
  Top 0.6: Q5.2 29.74,185.02 Q5.5 28.24,185.02 27.34,185.92 27.04,185.92 R36.2 | R38.2 R36.2 | R36.2 27.14,186.12 27.74,186.72 27.74,187.32 28.14,187.72 28.14,188.12 L11.1
  Bottom 0.2: v33.99,183.97 35.04,182.92
VBAT-ON  (1 unrouted)
  Top 0.2: 39.64,186.22 R41.1 38.84,186.82 37.34,186.82 37.04,186.52 Q4.2 | 39.64,186.22 40.24,185.62 40.24,179.42 | 47.61,96.62 T5.P$1 O42.P$1 IC1.52 | 39.64,186.22 39.64,187.42 R132.2
VBAT-SENSE  (via drill 0.3 pad 0.7)  (1 unrouted)
  Top 0.2: R100.1 40.64,169.12 41.24,168.52 41.24,165.02 | v21.71,95.32 21.71,95.42 20.81,96.32 15.41,96.32 14.01,97.72 14.01,109.82 16.01,111.82 16.01,115.52 20.91,120.42 | IC1.26 26.71,93.22 O15.P$1 T37.P$1 25.81,92.32 24.31,92.32 v23.51,91.52 23.51,90.92 C64.1
  Bottom 0.2: v21.71,95.32 22.41,95.32 23.71,94.02 23.71,91.72 v23.51,91.52
VBATLAN-SENSE  (via drill 0.3 pad 0.7)  (1 unrouted)
  Top 0.2: v22.41,96.12 21.81,96.72 15.61,96.72 14.41,97.92 14.41,109.62 16.41,111.62 16.41,115.32 | R101.1 40.64,170.42 41.64,169.42 41.64,164.82 | IC1.27 27.21,93.12 O16.P$1 T38.P$1 25.61,91.52 v24.81,91.52 C36.1
  Bottom 0.2: v22.41,96.12 22.41,95.92 24.81,93.52 v24.81,91.52
VBUS  (via drill 0.3 pad 0.7)  (1 unrouted)
  Top 0.2: IC1.54 42.41,97.62 v42.61,97.82
  Bottom 0.2: v42.61,97.82 46.51,93.92
VCAP
  Top 0.28: IC1.85 34.21,112.02 34.41,112.02
  Top 0.68: 34.41,112.02 34.41,113.72
  Top 0.8: 34.41,113.72 C54.+ 35.61,113.72 36.51,114.62 C53.1
VPS-ON  (1 unrouted)
  Top 0.2: Q4.5 37.04,183.62 36.94,183.52 36.94,179.62 R44.1 | 47.51,97.12 O41.P$1 T7.P$1 IC1.53
VPS-PWR
  Top 0.5: 33.64,196.22 33.64,198.12
  Top 0.6: 33.84,191.92 D4.C
  Top 0.8: L10.2 33.84,191.92
  Top 1: 33.64,198.12 33.64,200.71 32.94,201.42 32.94,207.72 33.57,208.36 33.57,212 J4.6 | D4.C 35.04,191.92 35.04,193.32 33.73,194.63 J3.6 33.65,196.21 33.64,196.22
VPS-PWR-F  (via drill 0.3 pad 0.7, 0.3 pad 0.8)
  Top 0.2: R23.2 30.34,181.02 v31.34,182.02
  Top 0.6: Q5.4 29.09,185.97 v30.09,186.97 L10.1
  Bottom 0.2: v31.34,182.02 30.34,183.02 30.34,186.72 v30.09,186.97
VPS-SENSE  (1 unrouted)
  Top 0.2: 17.61,114.72 17.61,106.32 18.61,105.32 19.21,105.32 20.31,104.22 C65.1 21.11,103.82 22.31,102.62 T3.P$1 O7.P$1 IC1.12 | R48.2 R49.1 34.64,180.12 34.64,179.22

## Text on the board
tPlace: (C) 2017 eLock Technologies LCC | ACB 1.0 | RIGHT | LEFT | J15 | J14 | (C) 2017 eLock Technologies LCC
Document: Left | Actuators | Right